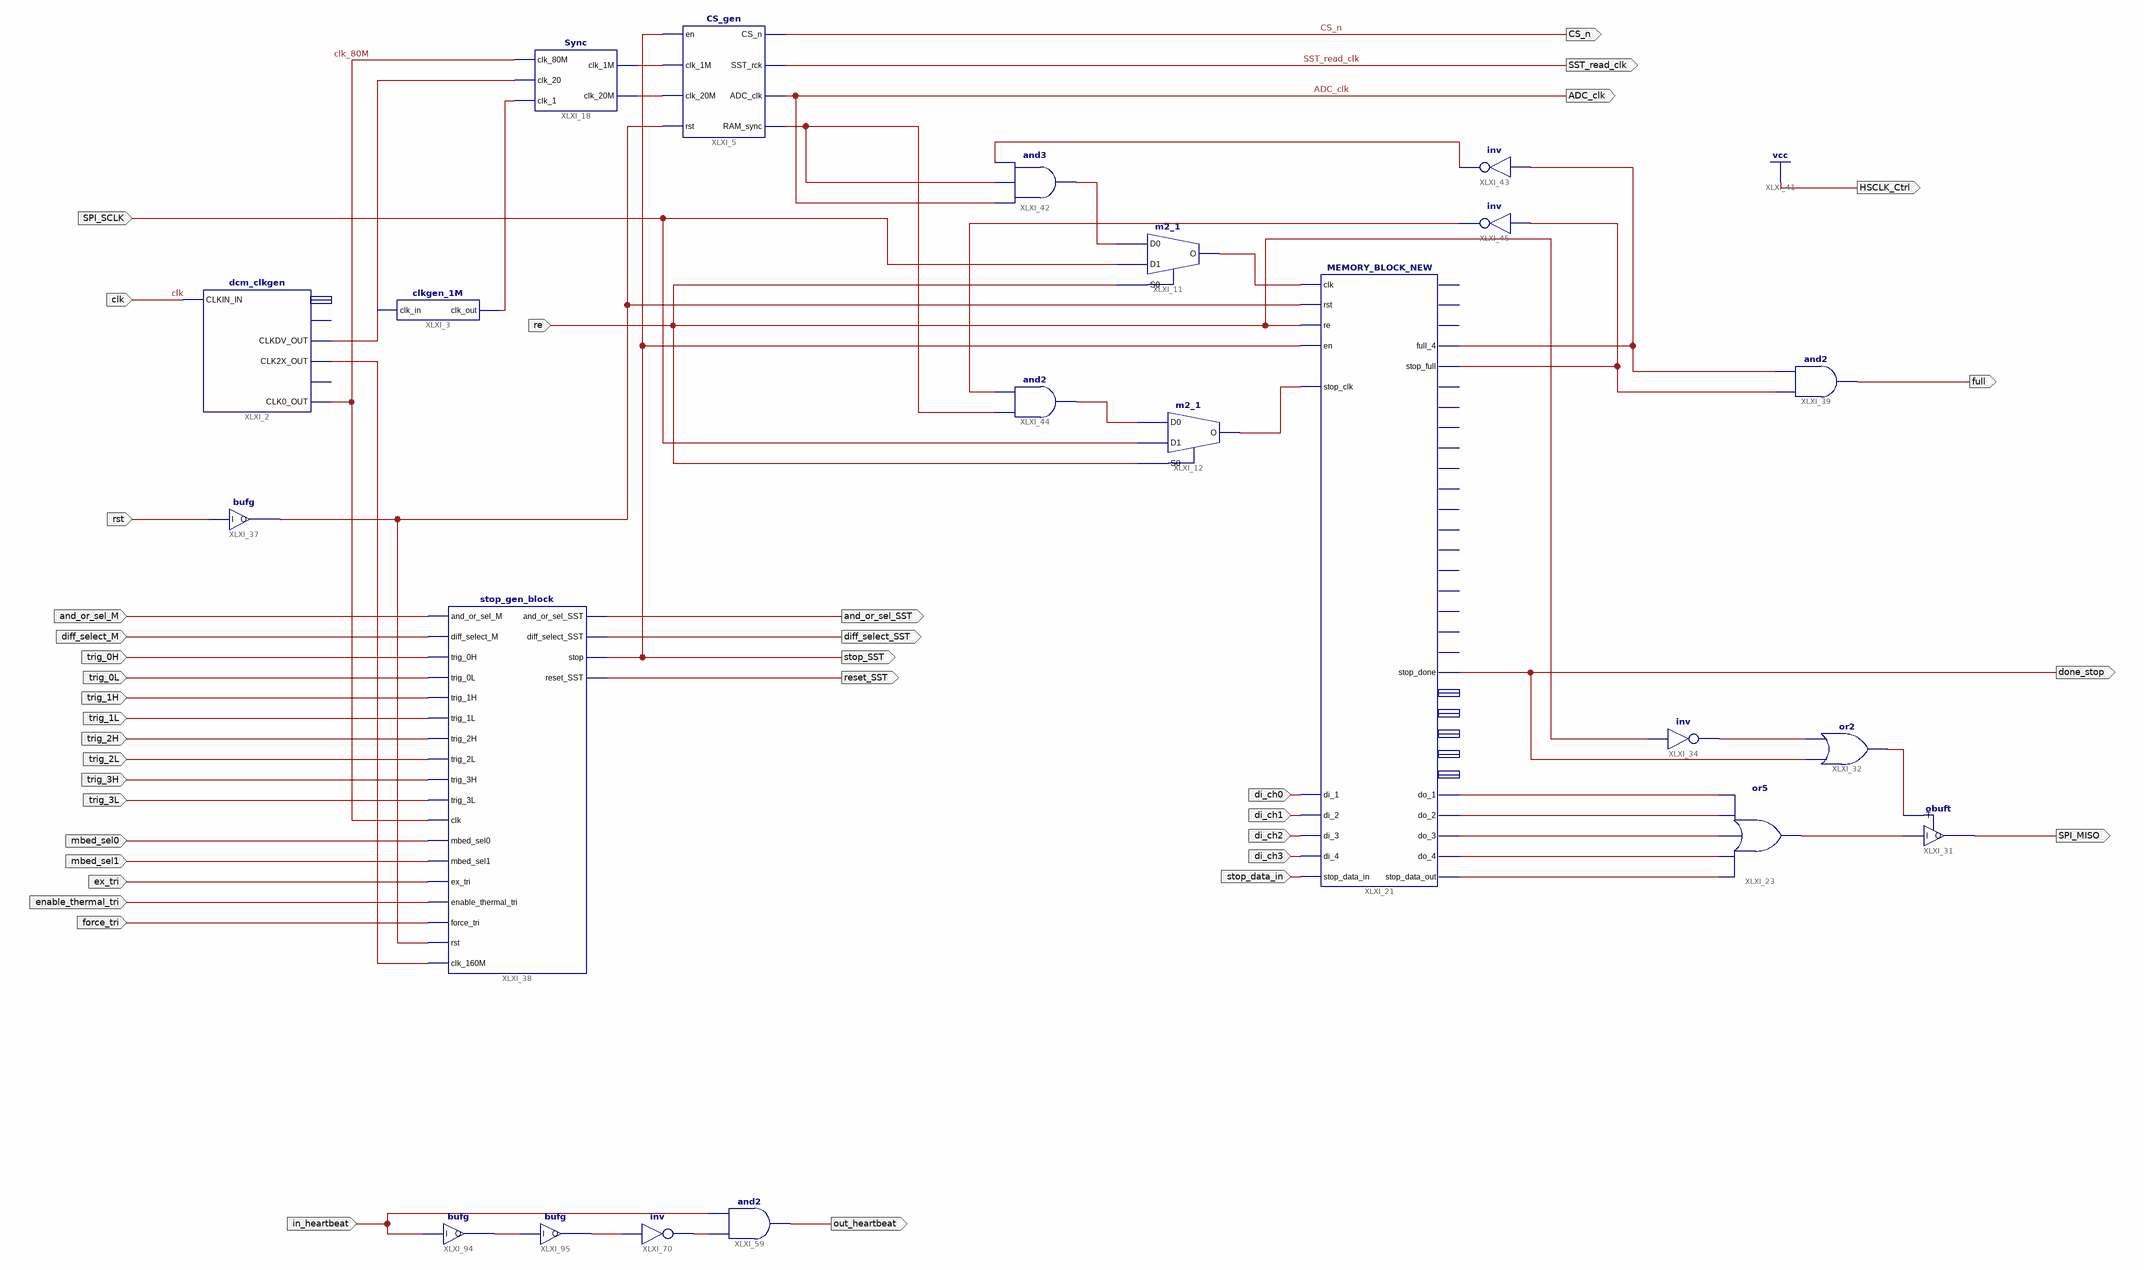
[diagram p0: schematic sheet 1]
// Xilinx ISE schematic Firmware_Top(1).sch (spartan3a) as structural Verilog: 22 symbols, 37 ports
module \Firmware_Top(1)  (
  input  clk,
  input  re,
  input  SPI_SCLK,
  input  rst,
  input  force_tri,
  input  enable_thermal_tri,
  input  ex_tri,
  input  mbed_sel1,
  input  mbed_sel0,
  input  trig_3L,
  input  trig_3H,
  input  trig_2L,
  input  trig_2H,
  input  trig_1L,
  input  trig_1H,
  input  trig_0L,
  input  trig_0H,
  input  diff_select_M,
  input  and_or_sel_M,
  input  di_ch0,
  input  di_ch1,
  input  di_ch2,
  input  di_ch3,
  input  stop_data_in,
  input  in_heartbeat,
  output CS_n,
  output SST_read_clk,
  output stop_SST,
  output diff_select_SST,
  output and_or_sel_SST,
  output SPI_MISO,
  output done_stop,
  output ADC_clk,
  output full,
  output HSCLK_Ctrl,
  output reset_SST,
  output out_heartbeat
);

  wire clk_1M, clk_20M, clk_80M, clk_test_mem, clk_test_stop, data_0, data_1, data_2, data_3, full_3,
       or_data, RAM_sync, stop_data, tri_ctrl, XLXN_32, XLXN_33, XLXN_147, XLXN_424, XLXN_426, XLXN_427,
       XLXN_429, XLXN_431, XLXN_441, XLXN_442, XLXN_469, XLXN_487, XLXN_488;

  dcm_clkgen XLXI_2 (
    .CLKIN_IN(clk), .CLKDV_OUT(clk_20M), .CLK2X_OUT(XLXN_442), .CLK0_OUT(clk_80M));  // open: STATUS_OUT, LOCKED_OUT, CLKIN_IBUFG_OUT
  Sync XLXI_18 (.clk_80M(clk_80M), .clk_20(clk_20M), .clk_1(clk_1M), .clk_1M(XLXN_33), .clk_20M(XLXN_32));
  clkgen_1M XLXI_3 (.clk_in(clk_20M), .clk_out(clk_1M));
  CS_gen XLXI_5 (
    .en(stop_SST), .clk_1M(XLXN_33), .clk_20M(XLXN_32), .rst(XLXN_441), .ADC_clk(ADC_clk),
    .SST_rck(SST_read_clk), .CS_n(CS_n), .RAM_sync(RAM_sync));
  m2_1 XLXI_12 (.D0(XLXN_427), .D1(SPI_SCLK), .S0(re), .O(clk_test_stop));
  m2_1 XLXI_11 (.D0(XLXN_424), .D1(SPI_SCLK), .S0(re), .O(clk_test_mem));
  bufg XLXI_37 (.I(rst), .O(XLXN_441));
  stop_gen_block XLXI_38 (
    .force_tri(force_tri), .enable_thermal_tri(enable_thermal_tri), .ex_tri(ex_tri), .mbed_sel1(mbed_sel1),
    .mbed_sel0(mbed_sel0), .trig_3L(trig_3L), .trig_3H(trig_3H), .trig_2L(trig_2L), .trig_2H(trig_2H),
    .trig_1L(trig_1L), .trig_1H(trig_1H), .trig_0L(trig_0L), .trig_0H(trig_0H),
    .diff_select_M(diff_select_M), .and_or_sel_M(and_or_sel_M), .clk(clk_80M), .rst(XLXN_441),
    .and_or_sel_SST(and_or_sel_SST), .diff_select_SST(diff_select_SST), .stop(stop_SST),
    .reset_SST(reset_SST), .clk_160M(XLXN_442));
  not XLXI_34 (XLXN_147, re);
  or XLXI_32 (tri_ctrl, done_stop, XLXN_147);
  obuft XLXI_31 (.I(or_data), .T(tri_ctrl), .O(SPI_MISO));
  or XLXI_23 (or_data, stop_data, data_3, data_2, data_1, data_0);
  MEMORY_BLOCK_NEW XLXI_21 (
    .en(stop_SST), .clk(clk_test_mem), .rst(XLXN_441), .re(re), .di_1(di_ch0), .di_2(di_ch1), .di_3(di_ch2),
    .di_4(di_ch3), .stop_clk(clk_test_stop), .stop_data_in(stop_data_in), .full_4(full_3),
    .stop_done(done_stop), .stop_full(XLXN_429), .stop_data_out(stop_data), .do_4(data_3), .do_3(data_2),
    .do_2(data_1), .do_1(data_0));  // open: start_1, start_2, start_3, start_4, stop_start, address_1, done_1, full_1, wait_sig_1, address_3, address_2, address_4, done_2, full_2, wait_sig_2, done_3, full_3, wait_sig_3, done_4, wait_sig_4, stop_address, stop_wait
  and XLXI_39 (full, XLXN_429, full_3);
  not XLXI_43 (XLXN_426, full_3);
  and XLXI_44 (XLXN_427, RAM_sync, XLXN_431);
  and XLXI_42 (XLXN_424, ADC_clk, RAM_sync, XLXN_426);
  not XLXI_45 (XLXN_431, XLXN_429);
  not XLXI_70 (XLXN_469, XLXN_488);
  and XLXI_59 (out_heartbeat, XLXN_469, in_heartbeat);
  bufg XLXI_94 (.I(in_heartbeat), .O(XLXN_487));
  bufg XLXI_95 (.I(XLXN_487), .O(XLXN_488));

  assign HSCLK_Ctrl = 1'b1;
endmodule
